# Altium schematic sheet Switches.SchDoc
size A4; SheetNumber: 14; SheetTotal: 16
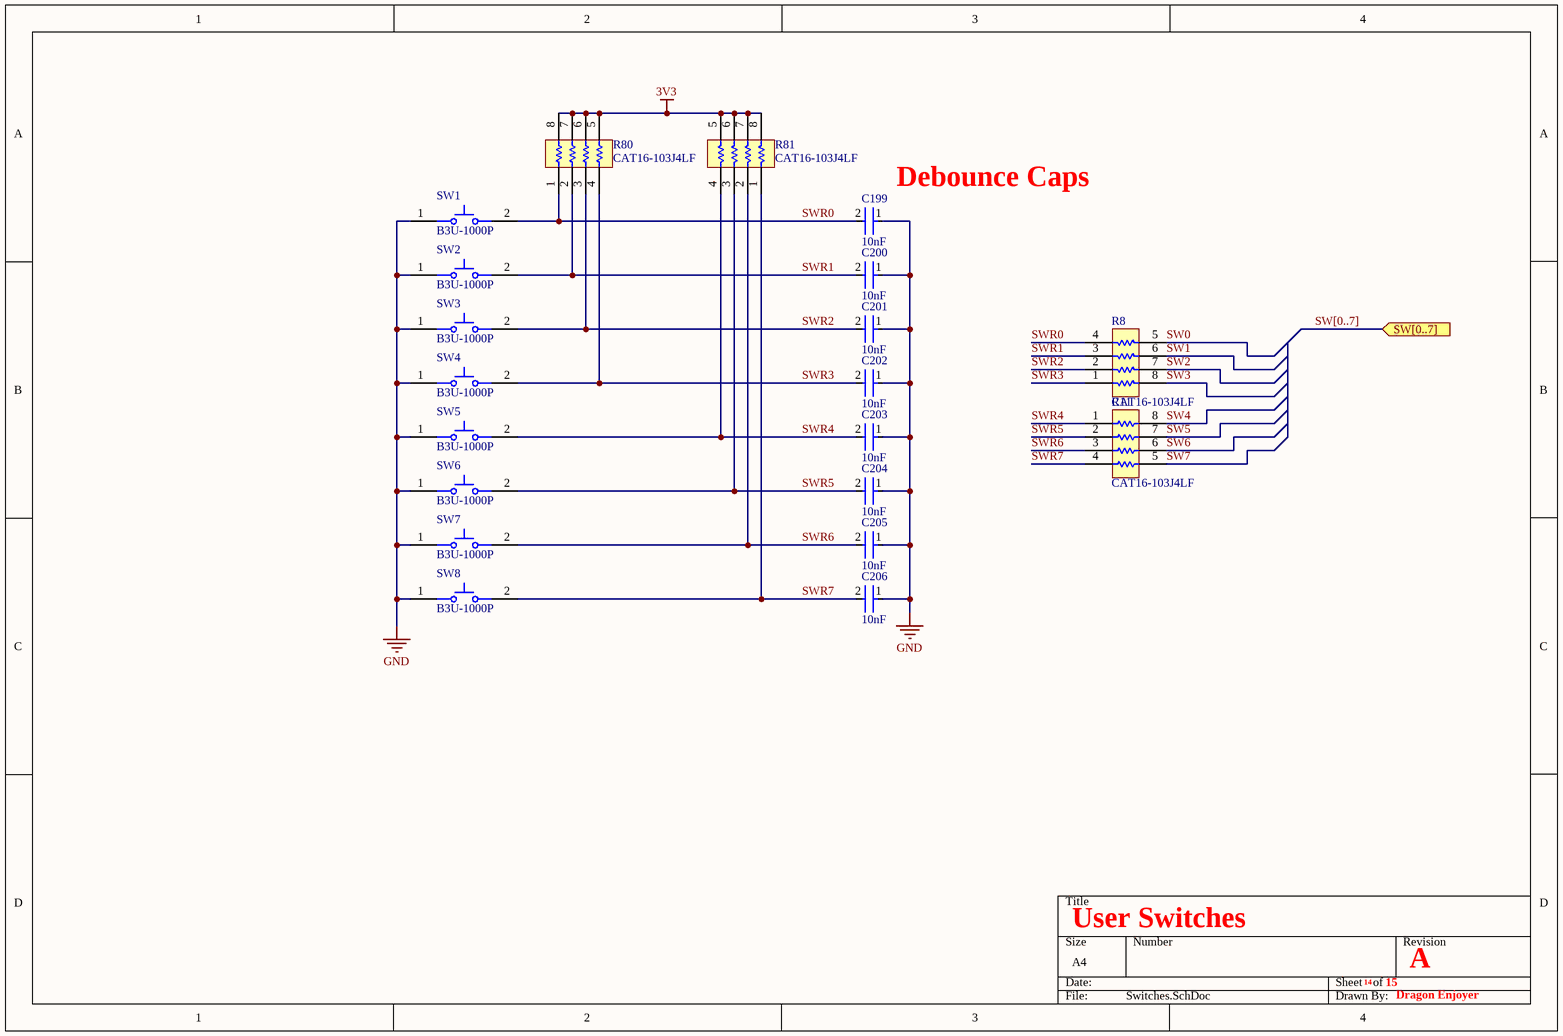
[diagram p0: Switches.SchDoc]

## Parts
C199  Capacitance: 10nF  [FP-GRM155-0_05-IPC_C]  (hidden comment: GRM155R71H103KA88D)
C200  Capacitance: 10nF  [FP-GRM155-0_05-IPC_C]  (hidden comment: GRM155R71H103KA88D)
C201  Capacitance: 10nF  [FP-GRM155-0_05-IPC_C]  (hidden comment: GRM155R71H103KA88D)
C202  Capacitance: 10nF  [FP-GRM155-0_05-IPC_C]  (hidden comment: GRM155R71H103KA88D)
C203  Capacitance: 10nF  [FP-GRM155-0_05-IPC_C]  (hidden comment: GRM155R71H103KA88D)
C204  Capacitance: 10nF  [FP-GRM155-0_05-IPC_C]  (hidden comment: GRM155R71H103KA88D)
C205  Capacitance: 10nF  [FP-GRM155-0_05-IPC_C]  (hidden comment: GRM155R71H103KA88D)
C206  Capacitance: 10nF  [FP-GRM155-0_05-IPC_C]  (hidden comment: GRM155R71H103KA88D)
R8  CAT16-103J4LF  [BOUR-CAT16-103J4LF_L]
R11  CAT16-103J4LF  [BOUR-CAT16-103J4LF_L]
R80  CAT16-103J4LF  [BOUR-CAT16-103J4LF_L]
R81  CAT16-103J4LF  [BOUR-CAT16-103J4LF_L]
SW1  B3U-1000P  [OMRON-B3U-1000_V]
SW2  B3U-1000P  [OMRON-B3U-1000_V]
SW3  B3U-1000P  [OMRON-B3U-1000_V]
SW4  B3U-1000P  [OMRON-B3U-1000_V]
SW5  B3U-1000P  [OMRON-B3U-1000_V]
SW6  B3U-1000P  [OMRON-B3U-1000_V]
SW7  B3U-1000P  [OMRON-B3U-1000_V]
SW8  B3U-1000P  [OMRON-B3U-1000_V]

## Ports
SW[0..7] (in)

## Nets
3V3: R80.5 R80.6 R80.7 R80.8 R81.5 R81.6 R81.7 R81.8
GND: C199.1 C200.1 C201.1 C202.1 C203.1 C204.1 C205.1 C206.1 SW1.1 SW2.1 SW3.1 SW4.1 SW5.1 SW6.1 SW7.1 SW8.1
SW0: R8.5
SW1: R8.6
SW2: R8.7
SW3: R8.8
SW4: R11.8
SW5: R11.7
SW6: R11.6
SW7: R11.5
SWR0: C199.2 R8.4 R80.1 SW1.2
SWR1: C200.2 R8.3 R80.2 SW2.2
SWR2: C201.2 R8.2 R80.3 SW3.2
SWR3: C202.2 R8.1 R80.4 SW4.2
SWR4: C203.2 R11.1 R81.4 SW5.2
SWR5: C204.2 R11.2 R81.3 SW6.2
SWR6: C205.2 R11.3 R81.2 SW7.2
SWR7: C206.2 R11.4 R81.1 SW8.2

## Buses and harness runs
bus SW[0..7] = port SW[0..7]

## Notes on the sheet
- (near C199) Debounce Caps
- User Switches
- 14
- 15
- A
- Dragon Enjoyer

## Library data of the parts
C199-C206 = CMP-2008-04637-5: Chip Multilayer Ceramic Capacitors for General Purpose, 0402, 10000pF, X7R, 15%, 10%, 50V; Voltage: 25V; Tolerance: 10%; Mount: Surface Mount; Lead Free: Lead Free; Radiation Hardening: No; Case Code (Imperial): 0402; REACH SVHC: No SVHC; Case/Package: 0402; Dielectric: X7R; Voltage Rating (DC): 50V; Max Operating Temperature: 125°C; Termination: SMD/SMT; Material: Ceramic; Width: 0.02inch; Package Quantity: 1; Voltage Rating: 50V; Thickness: 0.022inch; Packaging: Tape and Reel; Height: 0.5mm; Number of Pins: 2; Case Code (Metric): 1005; Min Operating Temperature: -55°C; Length: 1mm; Depth: 0.5mm
R8 R11 R80 R81 = CMP-2000-06067-1: CAT / CAY 16 Series - Chip Resistor Array, 10 KOhm, +/- 5%, 50 V, -55 to 125 degC, 8-Pin SMD, RoHS, Tape and Reel; Manufacturer: Bourns; Power Per Element: 62.5mW; Online Catalog: CAT16Series; Resistance (Ohms): 10k; Number of Resistors: 4; EDA / CAD Models: DownloadfromAcceleratedDesigns; Temperature Coefficient: ±200ppm/°C; Circuit Type: Isolated; Other Names: CAT16-103J4LFDKR; Package Reference: CAT16-103J4LF; Datasheet Version: 09/2014; Series: CAT16; Manufacturer URL: http://www.bourns.com/; Mounting Type: SurfaceMount; Datasheet URL: http://www.mouser.com/ds/2/54/ATCAY-777361.pdf; Category: Resistors; Height: 0.024"(0.60mm); Mounting Technology: SurfaceMount; Applications: -; Size / Dimension: 0.126"Lx0.061"W(3.20mmx1.55mm); Packaging: Digi-Reel®; Package / Case: 1206(3216Metric),Concave,LongSideTerminals; Supplier Device Package: 1206; RoHS Information: CAT16MaterialDeclaration; Number of Pins: 8; Family: ResistorNetworks,Arrays; Standard Package: 1; Package Description: 8-Pin Surface Mount Device, Body 3.2 x 1.55 mm, Pitch 0.8 mm; Operating Temperature: -55°C~125°C; Tolerance: ±5%
SW1-SW8 = CMP-011-00000-1: Tactile Switch, SPST-NO, 0.05 A, 12 V, -25 to 70 degC, 2-Pin SMD, RoHS, Tape and Reel; Manufacturer: Omron Electronic Components; Contact Current Rating: 50mA; Max Voltage Rating (DC): 12V; Resistance: 0.1Ohm; Max Contact Resistance: 100mohm; Throw Configuration: SPST; Operating Force: 153gf; IP Rating: IP40; Min Operating Temperature: -25°C; RoHS Compliant: True; Package Description: 2-Pin Surface Mount Device, Body 3 x 2.5 mm; Packaging: TapeandReel; Package Reference: B3U-1000; Datasheet URL: http://www.omron.com/ecb/products/pdf/en-b3u.pdf; Contact Material: Silver; Max Current Rating: 50mA; Max Operating Temperature: 70°C; Voltage Rating: 12V; Voltage Rating (DC): 12V; Datasheet Version: Jan-15; Manufacturer URL: http://www.omron.com/; Current Rating: 50mA; Case/Package: B3U-1000; Package Quantity: 3500; Mounting Technology: SM